# Altium schematic sheet Power.SchDoc
size A
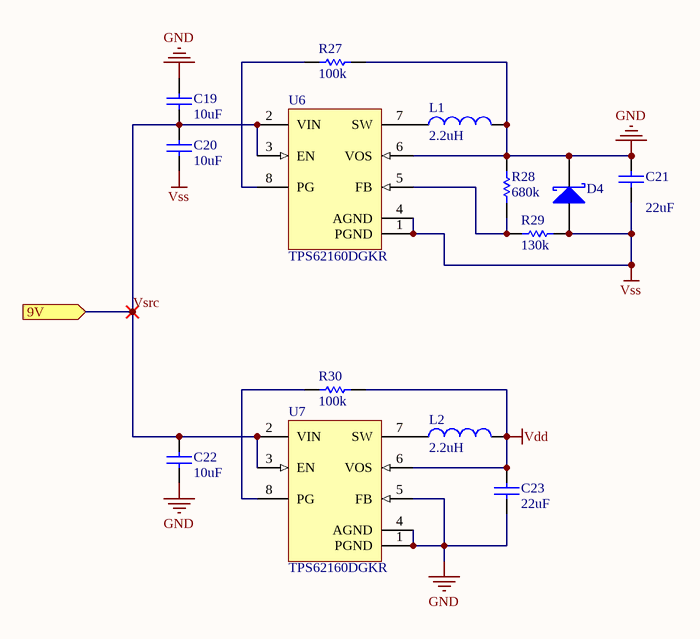
[diagram p0: Power.SchDoc]

## Parts
C19  value 10uF  [C1206]  (hidden comment: Cap)
C20  value 10uF  [C1206]  (hidden comment: Cap)
C21  value 22uF  [C1206]  (hidden comment: Cap)
C22  value 10uF  [C1206]  (hidden comment: Cap)
C23  value 22uF  [C1206]  (hidden comment: Cap)
D4  D Schottky  [425]  (value not drawn)
L1  value 2.2uH  [1608[0603]]  (hidden comment: Inductor)
L2  value 2.2uH  [1608[0603]]  (hidden comment: Inductor)
R27  value 100k  [C1206]  (hidden comment: Res1)
R28  value 680k  [C1206]  (hidden comment: Res1)
R29  value 130k  [C1206]  (hidden comment: Res1)
R30  value 100k  [C1206]  (hidden comment: Res1)
U6  TPS62160DGKR  [DGK8_N]
U7  TPS62160DGKR  [DGK8_N]

## Ports
9V (in)

## Nets
GND: C19.2 C21.2 C22.1 C23.1 D4.2(K) L1.2 R27.2 R28.2 U6.6(VOS) U7.1(PGND) U7.4(AGND) U7.5(FB)
Vdd: C23.2 L2.2 R30.2 U7.6(VOS)
Vss: C20.1 C21.1 D4.1(A) R29.2 U6.1(PGND) U6.4(AGND)
Vsrc: C19.1 C20.2 C22.2 U6.2(VIN) U6.3(EN) U7.2(VIN) U7.3(EN) ; port 9V
NetL1_1: L1.1 U6.7(SW)
NetL2_1: L2.1 U7.7(SW)
NetR27_1: R27.1 U6.8(PG)
NetR28_1: R28.1 R29.1 U6.5(FB)
NetR30_1: R30.1 U7.8(PG)

## Library data of the parts
C19-C23 = Cap: Capacitor; Published: 8-Jun-2000; LatestRevisionDate: 17-Jul-2002; LatestRevisionNote: Re-released for DXP Platform.; PackageReference: RAD-0.3; Publisher: Altium Limited; PackageDescription: Radial Cap, Thru-Hole; 2 Leads; 0.3 in Pin Spacing
D4 = D Schottky: Schottky Diode; Published: 8-Jun-2000; LatestRevisionDate: 17-Jul-2002; LatestRevisionNote: Re-released for DXP Platform.; PackageReference: SMB; Publisher: Altium Limited; PackageDescription: DO-214-AA/SMB; 2 C-Bend Leads; Body 5.3 x 3.6 mm, inc. leads (LxW); Code_JEDEC: DO-214-AA
L1 L2 = Inductor: Code_IEC: 1005; Published: 8-Jun-2000; LatestRevisionDate: 29-May-2009; LatestRevisionNote: IPC-7351 Footprint Added.; PackageReference: 0402-A; Publisher: Altium Limited; PackageDescription: Chip Inductor; Code_JEITA: 0402
R27-R30 = Res1: Resistor; Published: 8-Jun-2000; LatestRevisionDate: 17-Jul-2002; LatestRevisionNote: Re-released for DXP Platform.; PackageReference: AXIAL-0.3; Publisher: Altium Limited; PackageDescription: Axial Device, Thru-Hole; 2 Leads; 0.3 in Pin Spacing
U6 U7 = TPS62160DGKR: Buck Step Down Regulator with 3 to 17 V Input and 0.9 to 6 V Output, -40 to 85 degC, 8-Pin VSSOP (DGK), Green (RoHS & no Sb/Br); Manufacturer: Texas Instruments; Duty Cycle(Max)(%): 100; Iout(Max)(A): 1; Iq(Typ)(mA): 0.017; Rating: Catalog; SubFamily: Step-Down Regulator; Switch Current Limit(Typ)(A): 1.8; Synchronous Rectification: TRUE; Vin(Max)(V): 17; Vin(Min)(V): 3; Vout(Max)(V): 6; Vout(Min)(V): 0.9; DatasheetVersion: SLVSAM2A; PackageVersion: revE, May-2006; PackageReference: DGK8; PackageDescription: 8-Pin Thin Small Outline Package 3 x 3 mm Body ,0.65 mm Pitch; Supplier 1: Digi-Key; Supplier Part Number 1: TPS62160DGKR-ND; Supplier 2: Newark; Supplier Part Number 2: 92T2383; Supplier 3: Mouser; Supplier Part Number 3: 595-TPS62160DGKR; Eco-Plan: Green (RoHS & no Sb/Br); Regulated Outputs(#): 1; Topology: Buck; Mounting Technology: Surface Mount; Code_JEDEC: MO-187-AA; PartNumber: TPS62160DGKR; ComponentLink1Description: Datasheet; ComponentLink1URL: http://www.ti.com/general/docs/lit/getliterature.tsp?genericPartNumber=TPS62160&fileType=pdf; ComponentLink2Description: Package Specification; ComponentLink2URL: http://www.ti.com/lit/ml/mpds028d/mpds028d.pdf; ComponentLink3Description: URL Link1; ComponentLink3URL: Samples URL:http://www.ti.com/product/tps62160#samples